# EAGLE schematic swd (EAGLE 6.1)
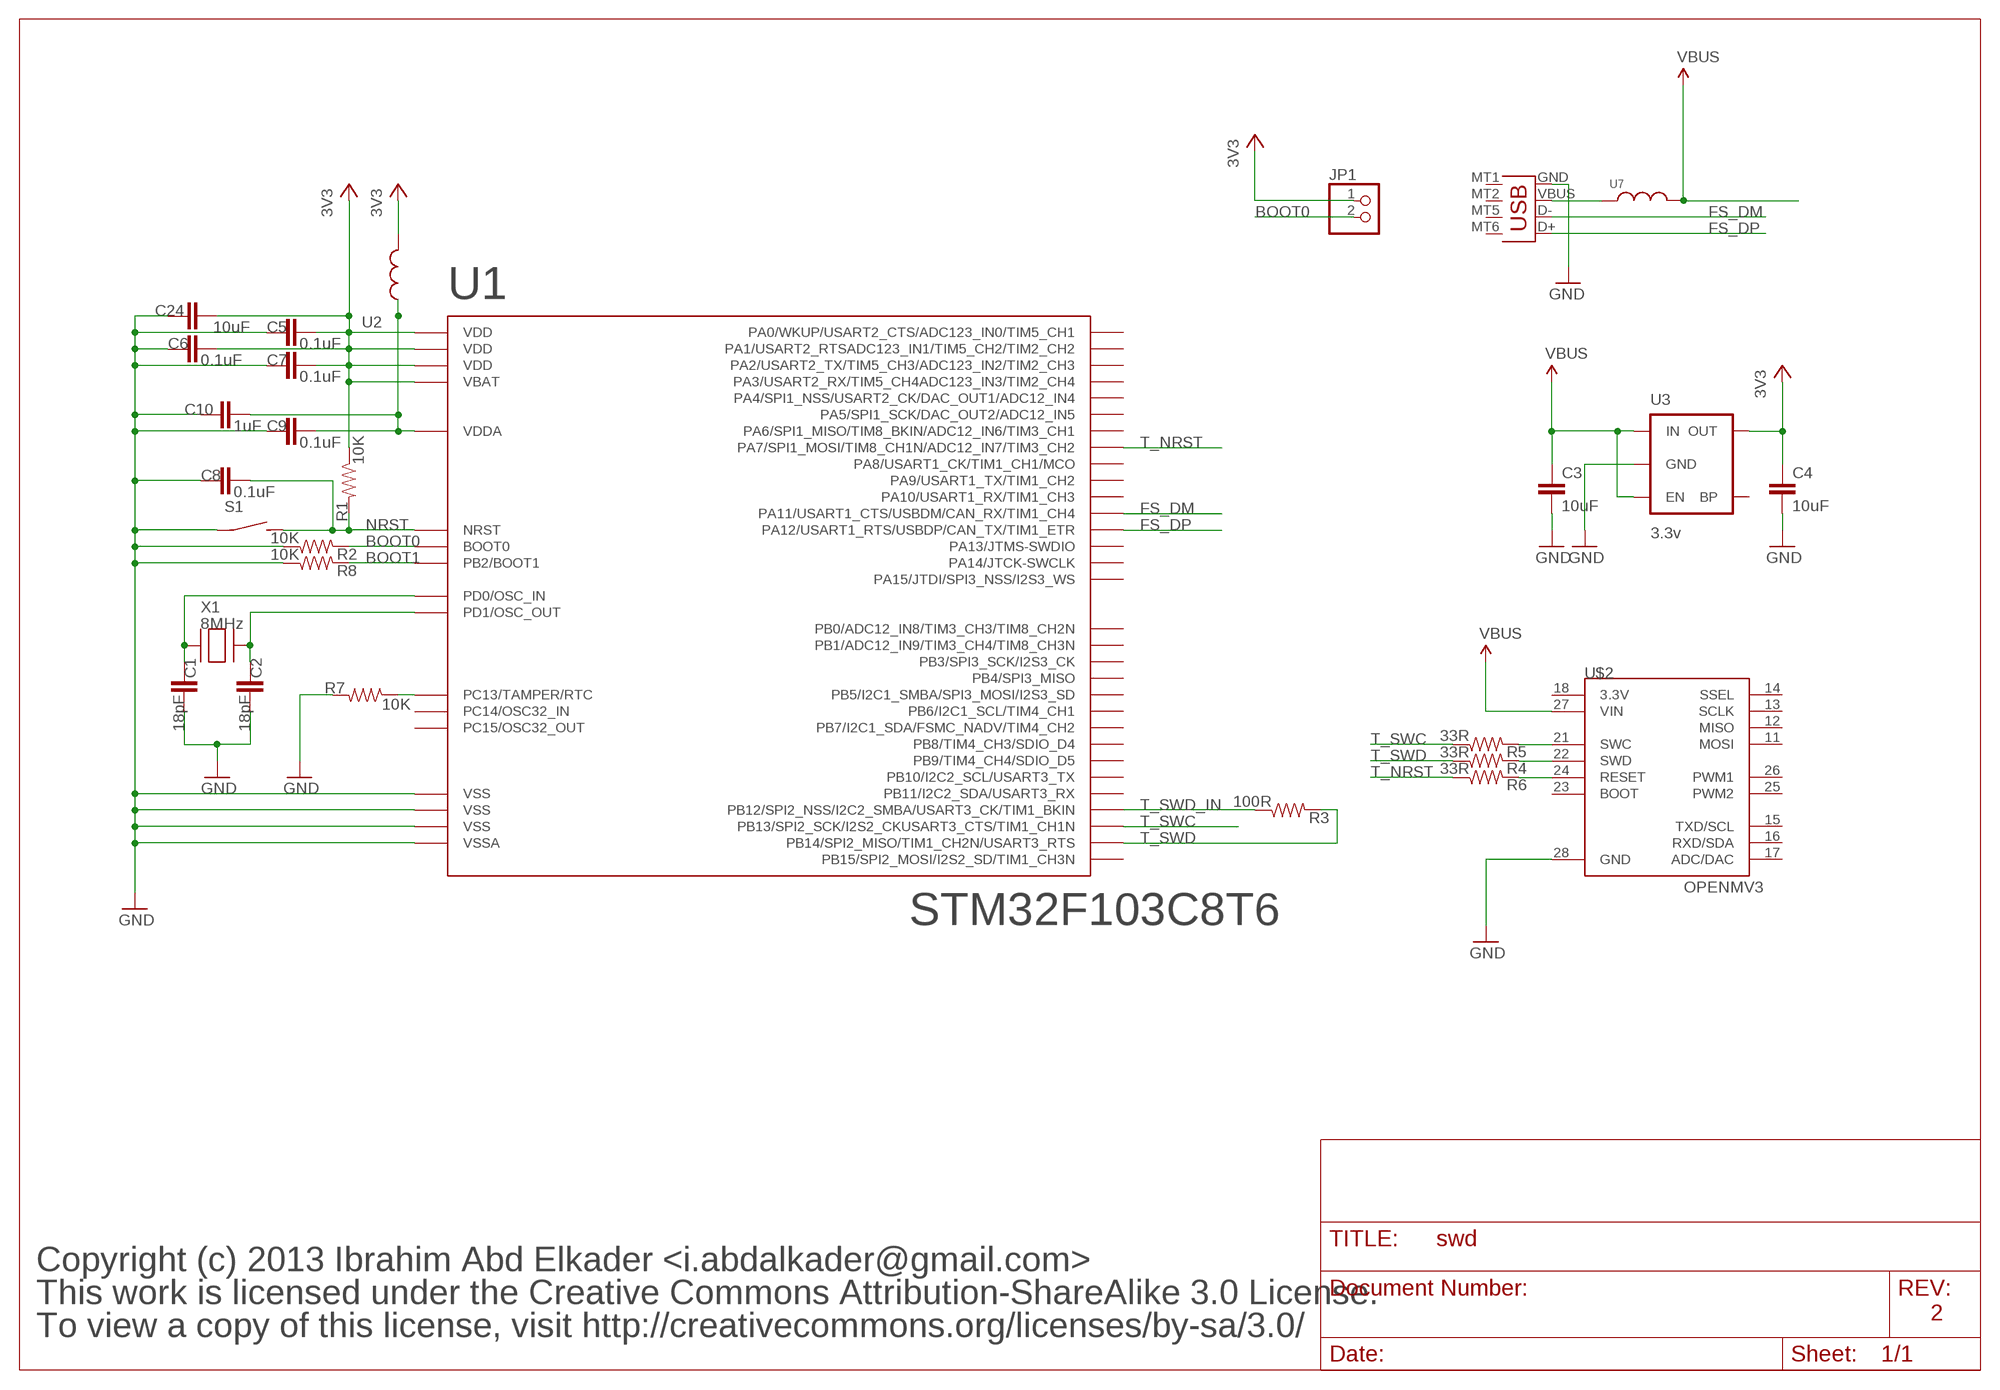
[diagram p0: schematic, sheet 1]

## Parts
C1  18pF  CAP0603-CAP  [0603-CAP]
C2  18pF  CAP0603-CAP  [0603-CAP]
C3  10uF  CAP0805  [0805]
C4  10uF  CAP0805  [0805]
C5  0.1uF  CAP0603-CAP  [0603-CAP]
C6  0.1uF  CAP0603-CAP  [0603-CAP]
C7  0.1uF  CAP0603-CAP  [0603-CAP]
C8  0.1uF  CAP0603-CAP  [0603-CAP]
C9  0.1uF  CAP0603-CAP  [0603-CAP]
C10  1uF  CAP0603-CAP  [0603-CAP]
C24  10uF  CAP0805  [0805]
JP1  PINHD-1X2  [1X02]
R1  10K  RESISTOR0603-RES  [0603-RES]
R2  10K  RESISTOR0603-RES  [0603-RES]
R3  100R  RESISTOR0603-RES  [0603-RES]
R4  33R  RESISTOR0603-RES  [0603-RES]
R5  33R  RESISTOR0603-RES  [0603-RES]
R6  33R  RESISTOR0603-RES  [0603-RES]
R7  10K  RESISTOR0603-RES  [0603-RES]
R8  10K  RESISTOR0603-RES  [0603-RES]
S1  SPST_3X4X2  [3X4X2TACT]
U1  STM32F103C8T6  [LQFP48]
U2  INDUCTOR0603  [0603]
U3  3.3v  V_REG_LDOSMD  [SOT23-5]
U7  INDUCTOR0603  [0603]
U$2  OPENMV3  [OPENMV3]
X1  8MHz  XTALNX5032  [NX5032]
X2  USB-MICROB  [USB-MICROB]

## Nets
3V3: C4.1 C5.2 C6.2 C7.2 C24.2 JP1.1 R1.1 U1.1(VBAT) U1.24(VDD) U1.36(VDD) U1.48(VDD) U2.2 U3.5(OUT)
BOOT0: JP1.2 R2.2 U1.44(BOOT0)
BOOT1: R8.2 U1.20(PB2/BOOT1)
FS_DM: U1.32(PA11/USART1_CTS/USBDM/CAN_RX/TIM1_CH4) X2.D-
FS_DP: U1.33(PA12/USART1_RTS/USBDP/CAN_TX/TIM1_ETR) X2.D+
GND: C1.1 C2.1 C3.2 C4.2 C5.1 C6.1 C7.1 C8.1 C9.1 C10.1 C24.1 R2.1 R7.2 R8.1 S1.P$1(P) U1.8(VSSA) U1.23(VSS) U1.35(VSS) U1.47(VSS) U3.2(GND) U$2.28(GND) X2.GND
N$1: R5.2 U$2.21(SWC)
N$2: R7.1 U1.2(PC13/TAMPER/RTC)
N$3: R4.2 U$2.22(SWD)
N$4: R6.2 U$2.24(RESET)
N$6: C1.2 U1.5(PD0/OSC_IN) X1.P$1
N$7: U7.1 X2.VBUS
N$8: C2.2 U1.6(PD1/OSC_OUT) X1.P$2
NRST: C8.2 R1.2 S1.P$2(S) U1.7(NRST)
T_NRST: R6.1 U1.17(PA7/SPI1_MOSI/TIM8_CH1N/ADC12_IN7/TIM3_CH2)
T_SWC: R5.1 U1.26(PB13/SPI2_SCK/I2S2_CKUSART3_CTS/TIM1_CH1N)
T_SWD: R3.2 R4.1 U1.27(PB14/SPI2_MISO/TIM1_CH2N/USART3_RTS)
T_SWD_IN: R3.1 U1.25(PB12/SPI2_NSS/I2C2_SMBA/USART3_CK/TIM1_BKIN)
VBUS: C3.1 U3.1(IN) U3.3(EN) U7.2 U$2.27(VIN)
VDDA: C9.2 C10.2 U1.9(VDDA) U2.1
Unconnected: U1.3(PC14/OSC32_IN) U1.4(PC15/OSC32_OUT) U1.10(PA0/WKUP/USART2_CTS/ADC123_IN0/TIM5_CH1) U1.11(PA1/USART2_RTSADC123_IN1/TIM5_CH2/TIM2_CH2) U1.12(PA2/USART2_TX/TIM5_CH3/ADC123_IN2/TIM2_CH3) U1.13(PA3/USART2_RX/TIM5_CH4ADC123_IN3/TIM2_CH4) U1.14(PA4/SPI1_NSS/USART2_CK/DAC_OUT1/ADC12_IN4) U1.15(PA5/SPI1_SCK/DAC_OUT2/ADC12_IN5) U1.16(PA6/SPI1_MISO/TIM8_BKIN/ADC12_IN6/TIM3_CH1) U1.18(PB0/ADC12_IN8/TIM3_CH3/TIM8_CH2N) U1.19(PB1/ADC12_IN9/TIM3_CH4/TIM8_CH3N) U1.21(PB10/I2C2_SCL/USART3_TX) U1.22(PB11/I2C2_SDA/USART3_RX) U1.28(PB15/SPI2_MOSI/I2S2_SD/TIM1_CH3N) U1.29(PA8/USART1_CK/TIM1_CH1/MCO) U1.30(PA9/USART1_TX/TIM1_CH2) U1.31(PA10/USART1_RX/TIM1_CH3) U1.34(PA13/JTMS-SWDIO) U1.37(PA14/JTCK-SWCLK) U1.38(PA15/JTDI/SPI3_NSS/I2S3_WS) U1.39(PB3/SPI3_SCK/I2S3_CK) U1.40(PB4/SPI3_MISO) U1.41(PB5/I2C1_SMBA/SPI3_MOSI/I2S3_SD) U1.42(PB6/I2C1_SCL/TIM4_CH1) U1.43(PB7/I2C1_SDA/FSMC_NADV/TIM4_CH2) U1.45(PB8/TIM4_CH3/SDIO_D4) U1.46(PB9/TIM4_CH4/SDIO_D5) U3.4(BP) U$2.11(MOSI) U$2.12(MISO) U$2.13(SCLK) U$2.14(SSEL) U$2.15(TXD/SCL) U$2.16(RXD/SDA) U$2.17(ADC/DAC) U$2.18(3.3V) U$2.23(BOOT) U$2.25(PWM2) U$2.26(PWM1) X2.MT1(GND1) X2.MT2(GND2) X2.MT5(GND3) X2.MT6(GND4)

## Notes on the sheet
- Copyright (c) 2013 Ibrahim Abd Elkader <i.abdalkader@gmail.com>
- This work is licensed under the Creative Commons Attribution-ShareAlike 3.0 License.
- 2
- To view a copy of this license, visit http://creativecommons.org/licenses/by-sa/3.0/

## Library data of the parts
C1-C10 C24 = sfe:CAP: Capacitor Standard 0603 ceramic capacitor, and 0.1" leaded capacitor.
JP1 = pinhead:PINHD-1X2: PIN HEADER
R1-R8 = sfe:RESISTOR: Resistor Basic schematic elements and footprints for 0603, 1206, and PTH resistors.
S1 = bt_electromech:SPST: SPST SWITCH
U1 = stm32:STM32F103C8T6
U2 U7 = sfe:INDUCTOR: Inductors Basic Inductor/Choke - 0603 and 1206. Footprints are not proven and vary greatly between part numbers.
U3 = SparkFun:V_REG_LDO: Voltage Regulator LDO Standard 150mA LDO voltage regulator in SOT-23 layout. Micrel part MIC5205. BP (by-pass) pin is used to lower output noise with 470pF cap.
U$2 = openmv:OPENMV3
X1 = adafruit:XTAL: Low cost SMT crystals, no capacitors included http://www.ladyada.net/library/eagle
X2 = sfe:USB: USB Connectors USB-B-PTH is fully proven SKU : PRT-00139 USB-miniB is fully proven SKU : PRT-00587 USB-A-PCB is untested. USB-A-H is throughly reviewed, but untested. Spark Fun Electronics SKU : PRT-00437 USB-B-SMT is throughly reviewed, but untested. Needs silkscreen touching up. USB-A-S has not been used/tested USB-MB-H has not been used/tested

## Net classes
1 vcc: width 1.016 mm, clearance 0.203 mm
2 antenna: width 0.363 mm, clearance 0.305 mm
3 1.8v: width 0.457 mm, clearance 0.254 mm